# EAGLE schematic LCD16x02_ENCODER_ESP32_CIRCUIT (EAGLE 9.6.2)
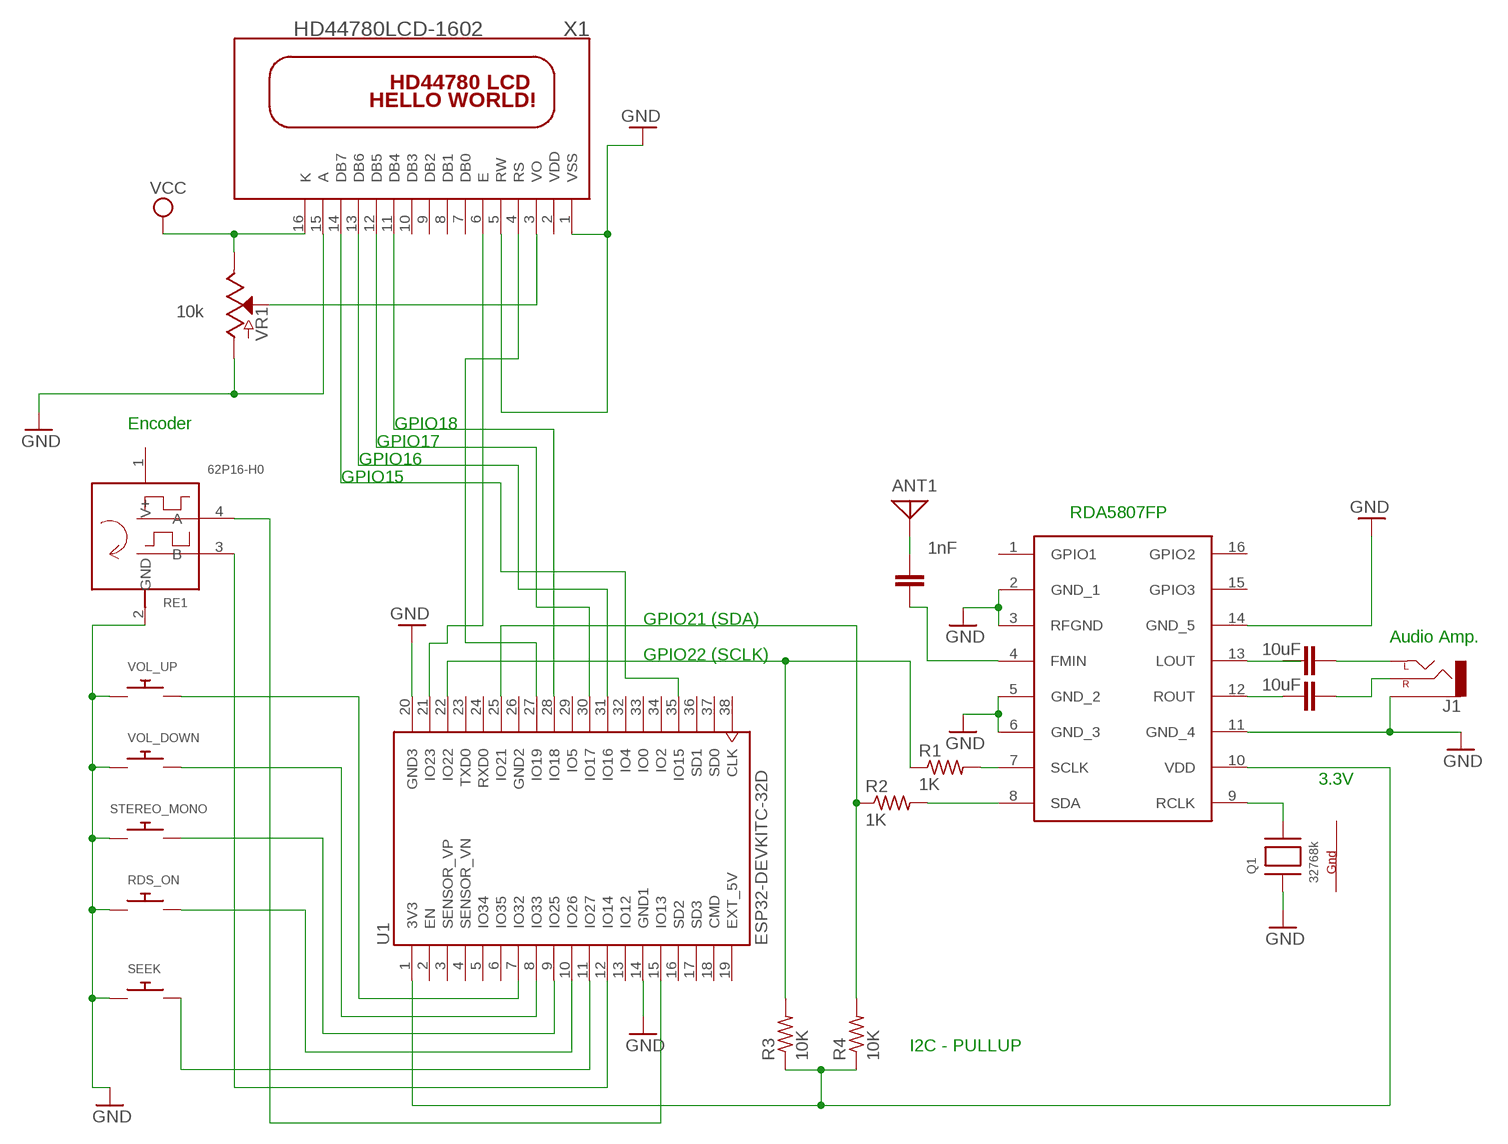
[diagram p0: schematic, sheet 1]
C1 (C): C: 1nF
C2 (C): C: 10uF
C3 (C): C: 10uF

## Parts
ANT1  ANTENNA  [PAD-01]
J1  AUDIO_JACK_2.5MMSPECIAL_POGO_PINS  [STEREOJACK2.5MM_SPECIAL_POGOPINS]
Q1  32768k  XTAL-4-3225  [NX3225]
R1  1K  R-US_0204/2V  [0204V]
R2  1K  R-US_0204/2V  [0204V]
R3  10K  R-US_0204/2V  [0204V]
R4  10K  R-US_0204/2V  [0204V]
RDS_ON  SWITCH_PUSHBUTTONC&K_KSS  [BTN_CK_KSS]
RE1  62P16-H0  [62P]
SEEK  SWITCH_PUSHBUTTONC&K_KSS  [BTN_CK_KSS]
STEREO_MONO  SWITCH_PUSHBUTTONC&K_KSS  [BTN_CK_KSS]
U1  ESP32-DEVKITC-32D  [MODULE_ESP32-DEVKITC-32D]
U$1  RDA5807FPRDA5807FP  [RDA5807FP]
VOL_DOWN  SWITCH_PUSHBUTTONC&K_KSS  [BTN_CK_KSS]
VOL_UP  SWITCH_PUSHBUTTONC&K_KSS  [BTN_CK_KSS]
VR1  10k  POTENTIOMETER-PTH-9MM-1/20W-20%  [POT-PTH-ALPS]
X1  HD44780LCD-1602  [LCD1602]

## Nets
GND: J1.RING1(SLEEVE) Q1.1(X1) RDS_ON.P$1 RE1.2(GND) SEEK.P$1 STEREO_MONO.P$1 U1.14(GND1) U1.20(GND3) U$1.2(GND_1) U$1.3(RFGND) U$1.5(GND_2) U$1.6(GND_3) U$1.11(GND_4) U$1.14(GND_5) VOL_DOWN.P$1 VOL_UP.P$1 VR1.P$3(A) X1.15(A)
N$1: R1.2 U$1.7(SCLK)
N$2: R2.2 U$1.8(SDA)
N$3: U$1.13(LOUT)
N$4: R2.1 R4.2 U1.25(IO21)
N$5: R1.1 R3.2 U1.22(IO22)
N$7: U$1.12(ROUT)
N$8: J1.SHIELD(LEFT)
N$9: ANT1.1
N$10: STEREO_MONO.P$2 U1.9(IO25)
N$11: U$1.4(FMIN)
N$12: J1.TIP(RIGHT)
N$13: Q1.3(X2) U$1.9(RCLK)
N$14: VR1.P$2(S) X1.3(VO)
N$15: U1.28(IO18) X1.11(DB4)
N$16: SEEK.P$2 U1.11(IO27)
N$17: U1.30(IO17) X1.12(DB5)
N$18: U1.31(IO16) X1.13(DB6)
N$19: U1.35(IO15) X1.14(DB7)
N$20: U1.7(IO32) VOL_UP.P$2
N$21: RDS_ON.P$2 U1.10(IO26)
N$22: U1.8(IO33) VOL_DOWN.P$2
N$23: U1.27(IO19) X1.4(RS)
N$24: U1.21(IO23) X1.6(E)
N$25: R3.1 R4.1 U1.1(3V3) U$1.10(VDD)
N$26: RE1.3(B) U1.12(IO14)
N$27: RE1.4(A) U1.15(IO13)
VCC: VR1.P$1(E) X1.16(K)
VSS: X1.1(VSS) X1.5(RW) ; supply symbol labelled GND
Unconnected: RE1.1(V+) U1.2(EN) U1.3(SENSOR_VP) U1.4(SENSOR_VN) U1.5(IO34) U1.6(IO35) U1.13(IO12) U1.16(SD2) U1.17(SD3) U1.18(CMD) U1.23(TXD0) U1.24(RXD0) U1.29(IO5) U1.32(IO4) U1.33(IO0) U1.34(IO2) U1.36(SD1) U1.37(SD0) U1.38(CLK) U$1.1(GPIO1) U$1.15(GPIO3) U$1.16(GPIO2) X1.2(VDD) X1.7(DB0) X1.8(DB1) X1.9(DB2) X1.10(DB3)

## Notes on the sheet
- Encoder | GPIO18
- GPIO17
- GPIO16
- GPIO15
- RDA5807FP
- GPIO21 (SDA)
- Audio Amp.
- GPIO22 (SCLK)
- 3.3V
- I2C - PULLUP

## Power pins joined to a net without a drawn wire
EXT_5V: U1.19(EXT_5V)
G1: Q1.4(G1)
G2: Q1.2(G2)
GND2: U1.26(GND2)

## Library data of the parts
ANT1 = discrete:ANTENNA: Antenna
J1 = SparkFun-Connectors:AUDIO_JACK_2.5MM: Audio Jack 2.5mm variants of PTH and SMT audio jacks. SparkFun Products: SparkFun PicoBoard <https://www.sparkfun.com/products/11888>- 2.5mm SMD
Q1 = adafruit:XTAL-4: Classic 4-pin 3.2 x 2.5mm crystal
R1-R4 = adafruit:R-US_: RESISTOR, American symbol
RDS_ON SEEK STEREO_MONO VOL_DOWN VOL_UP = adafruit:SWITCH_PUSHBUTTON: Buttons SOFTTOUCHSMD_SJ - Soft touch temporary push button (Super Junk Akihabara) Compatible with SKPMANE010 [Mouser: 688-SKPMAN] C&K_KSS = Digikey: KSS221GLFS
RE1 = rotary-encoder:62P*0
U1 = ESP32-DEVKITC-32D:ESP32-DEVKITC-32D: Eval Board For Esp-Wroom-32 Check prices <https://pricing.snapeda.com/parts/ESP32-DEVKITC-32D/Espressif%20Systems/view-part?ref=eda>; AVAILABILITY: Warning; DESCRIPTION: WiFi Development Tools (802.11) ESP32 General Development Kit, ESP32-WROOM-32D on the board; MF: Espressif Systems; MP: ESP32-DEVKITC-32D; PACKAGE: None; PRICE: None; PURCHASE-URL: https://pricing.snapeda.com/search/part/ESP32-DEVKITC-32D/?ref=eda
U$1 = RDA5807FP:RDA5807FP
VR1 = SparkFun-Resistors:POTENTIOMETER: Potentiometer (Pot) Three-terminal potentiometers, with an adjustable wiper and two adjustable resistors. A pot can be used to create a configurable voltage divider, or as a variable resistor. Variants ALPS_POT and ALPS_POT_KIT - PTH, breadboard compatible, 9mm square pots Rotary Potentiometer - Linear (10k ohm) <https://www.sparkfun.com/products/9288> (COM-09288) The KIT variant exposes copper on only one side of the PTH pad, so the part can only be assembled on one side of the PCB. Useful for beginner soldering kits.; PROD_ID: RES-09177; SF_SKU: COM-09288
X1 = adafruit:HD44780LCD: HD44780 LCD Standard character type LCDs, available in sizes from 8x1 to 40x4!